# Altium schematic sheet 0061_DG2 DISPLAY - HDMI.SchDoc
size 848 x 558 mm
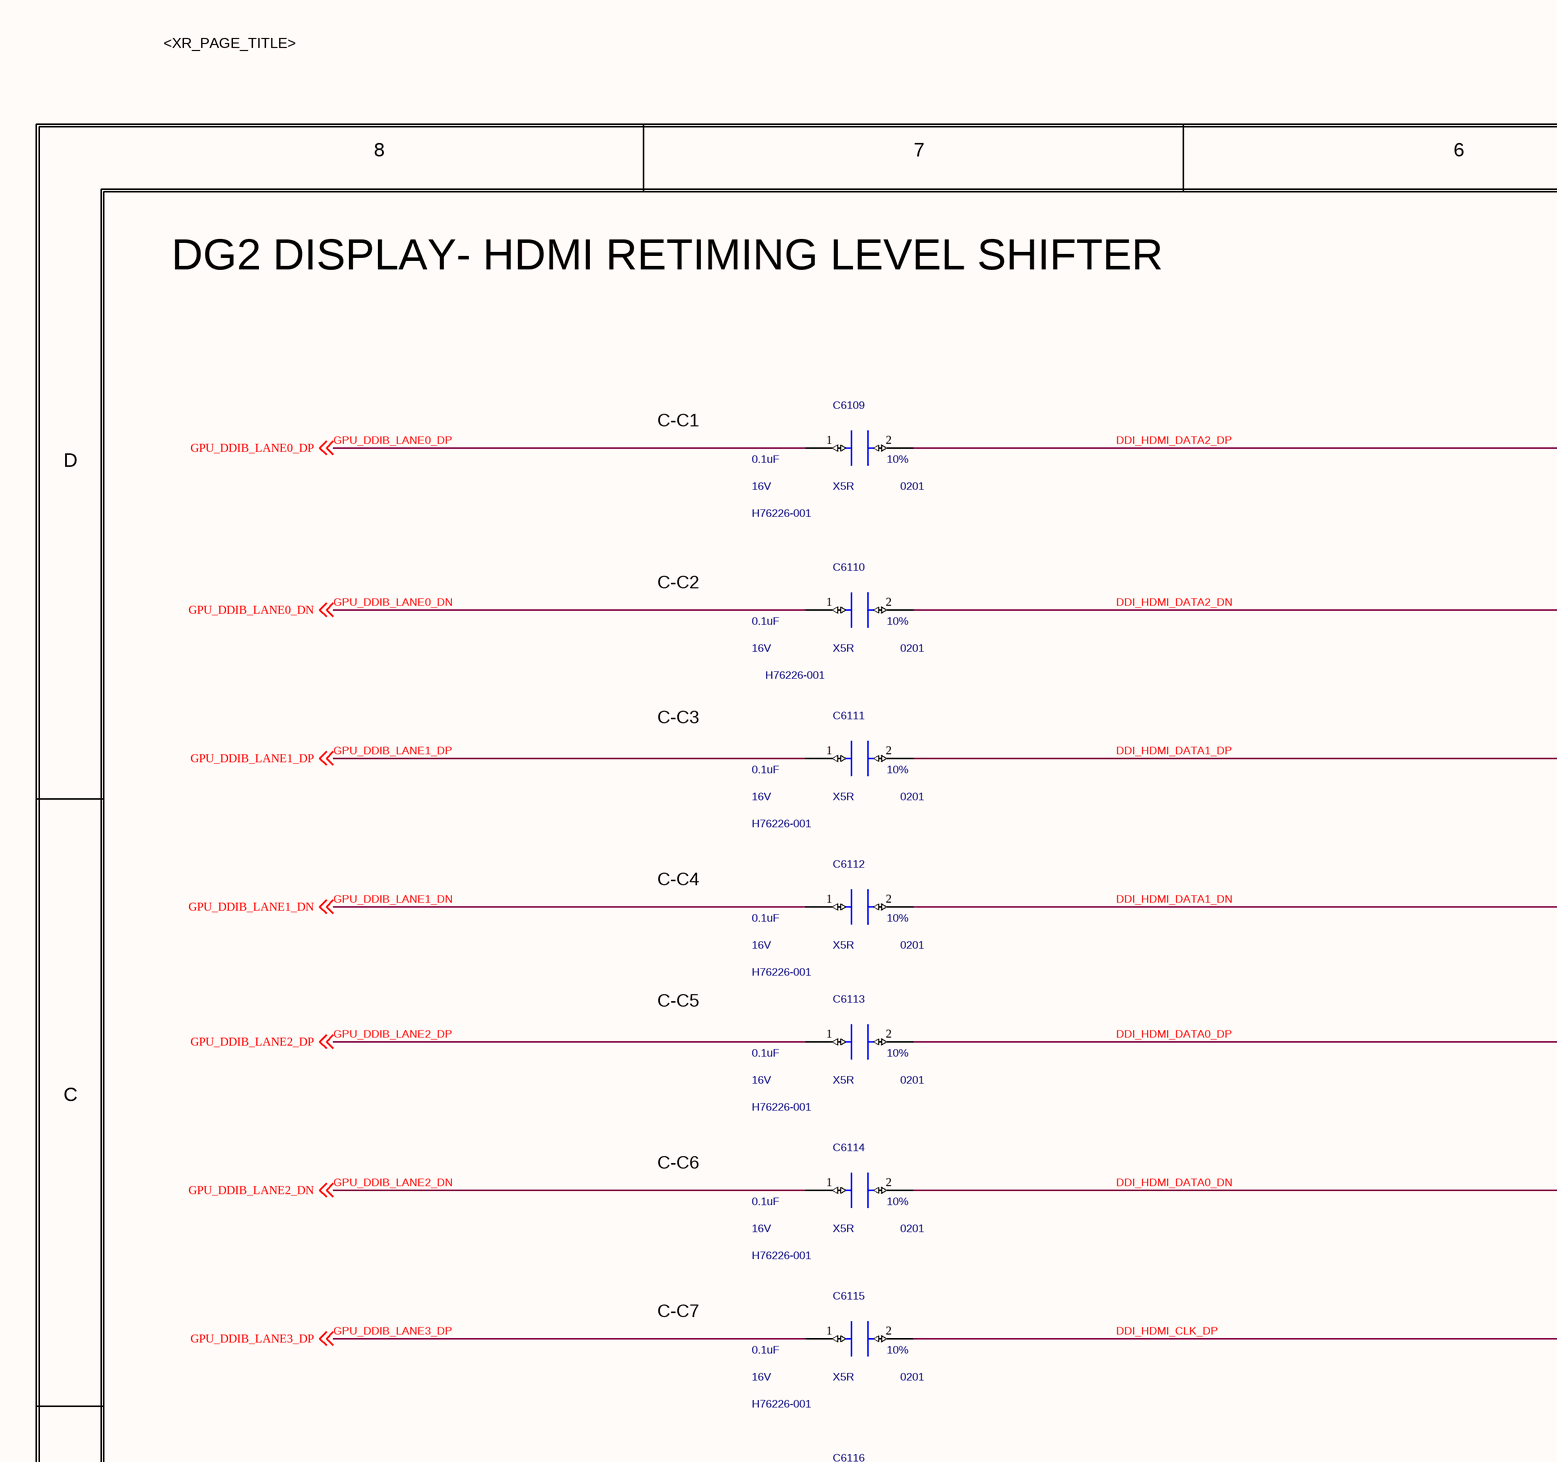
[diagram p0: 0061_DG2 DISPLAY - HDMI.SchDoc, top left]
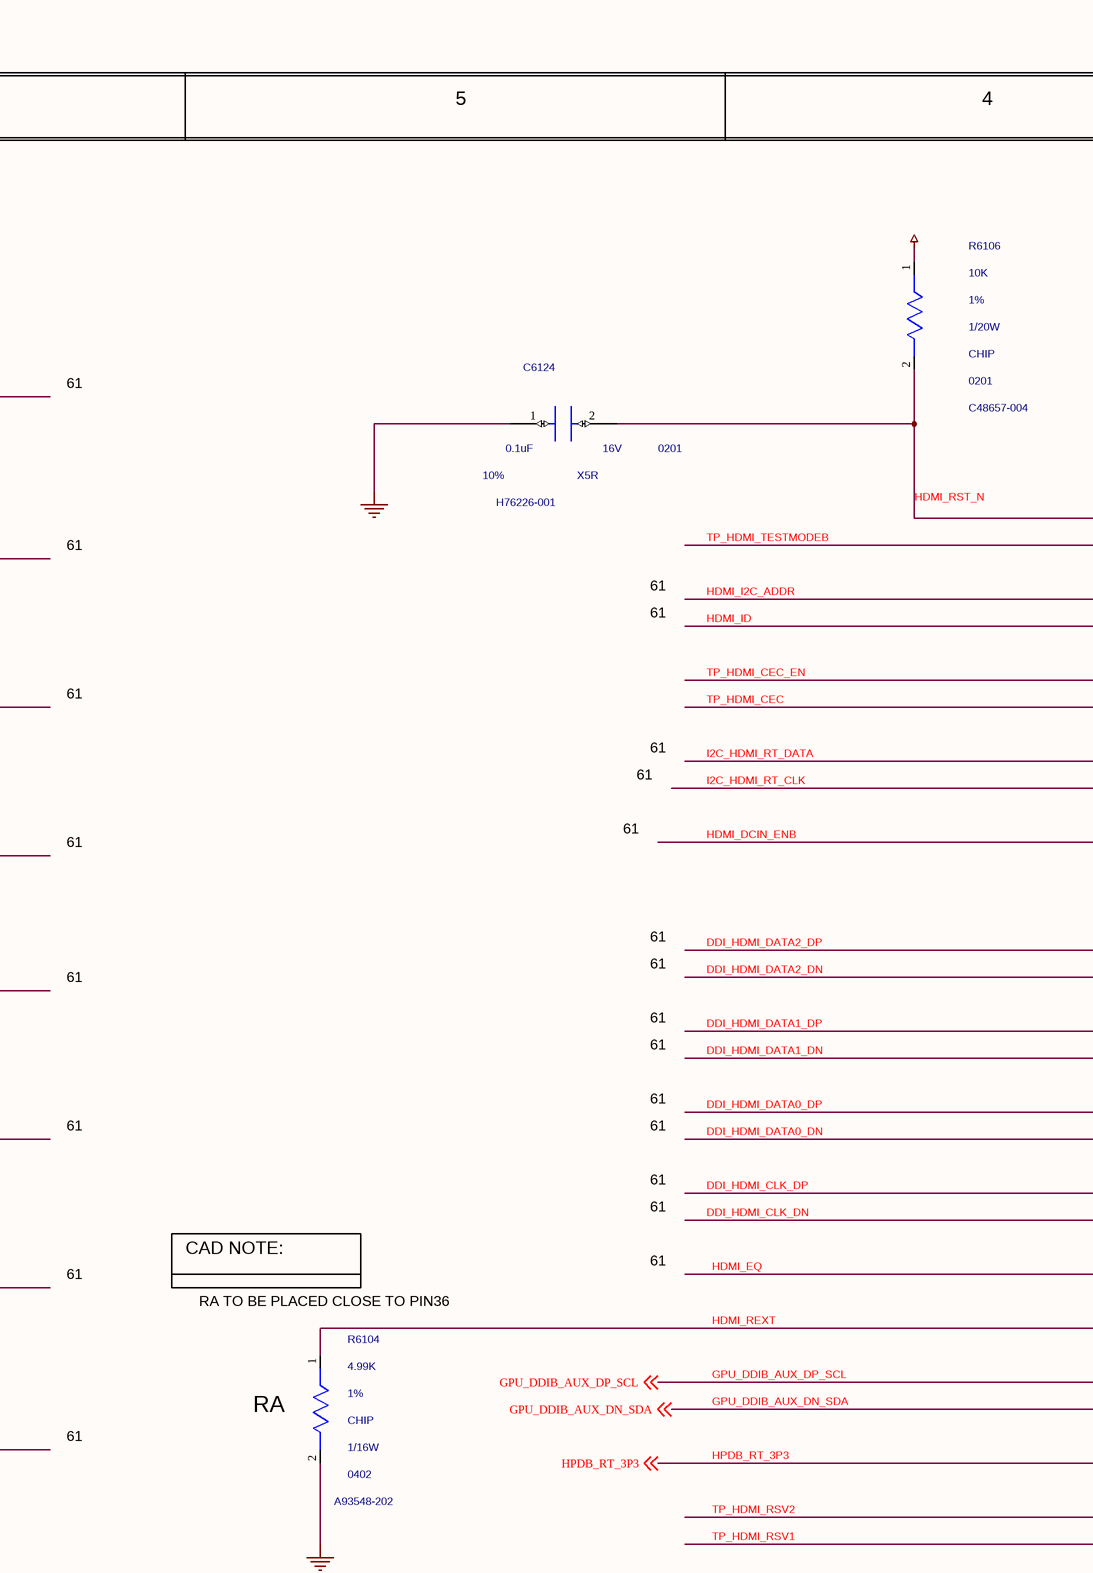
[diagram p1: 0061_DG2 DISPLAY - HDMI.SchDoc, top middle]
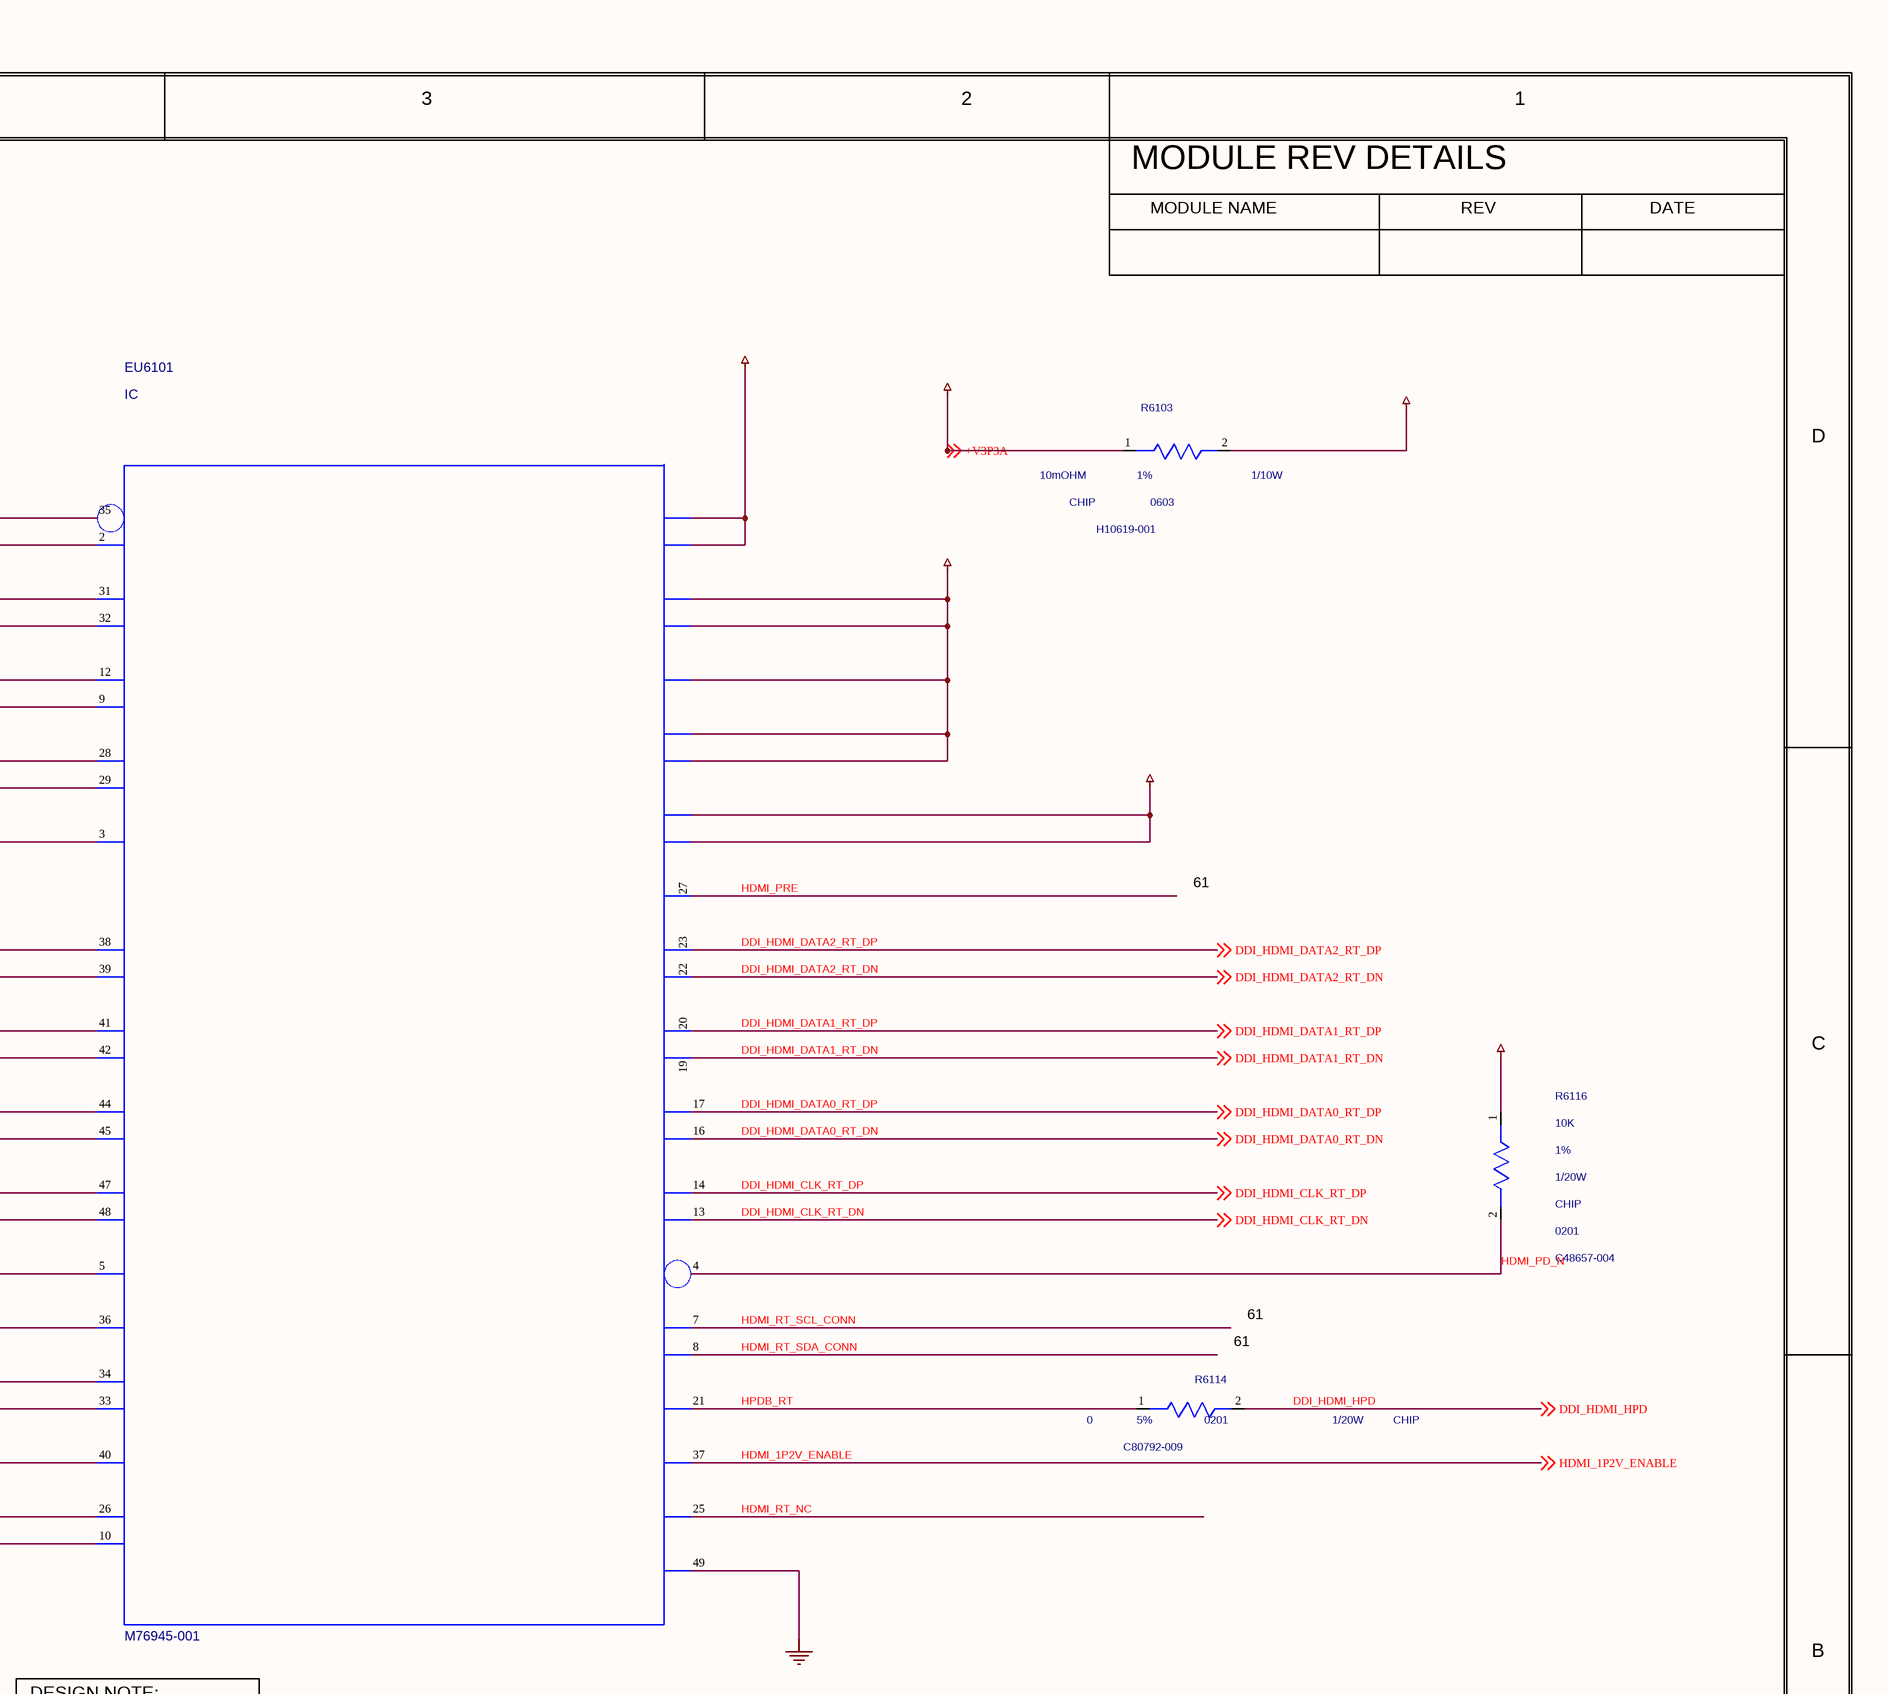
[diagram p2: 0061_DG2 DISPLAY - HDMI.SchDoc, top right]
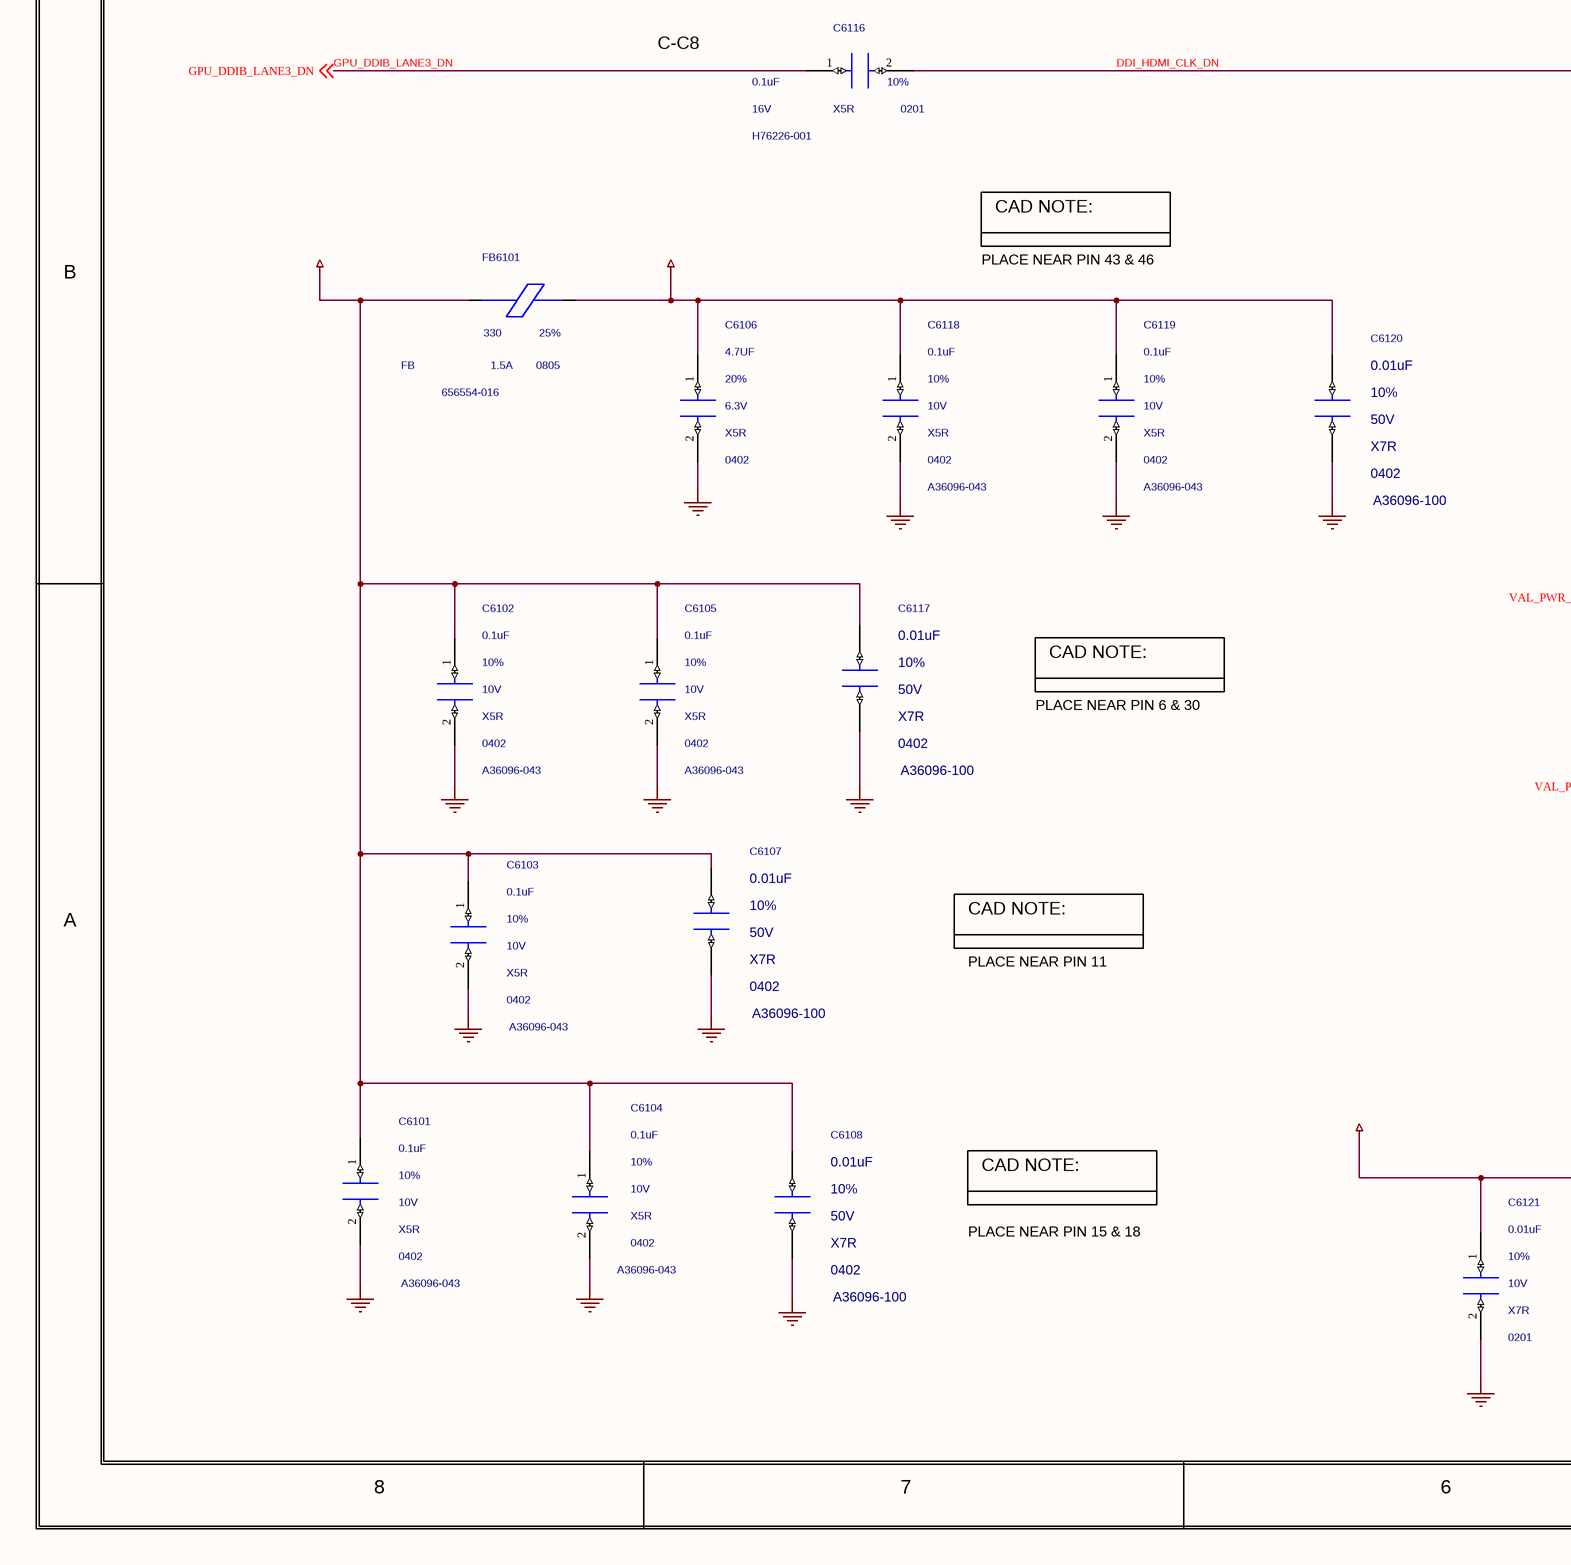
[diagram p3: 0061_DG2 DISPLAY - HDMI.SchDoc, bottom left]
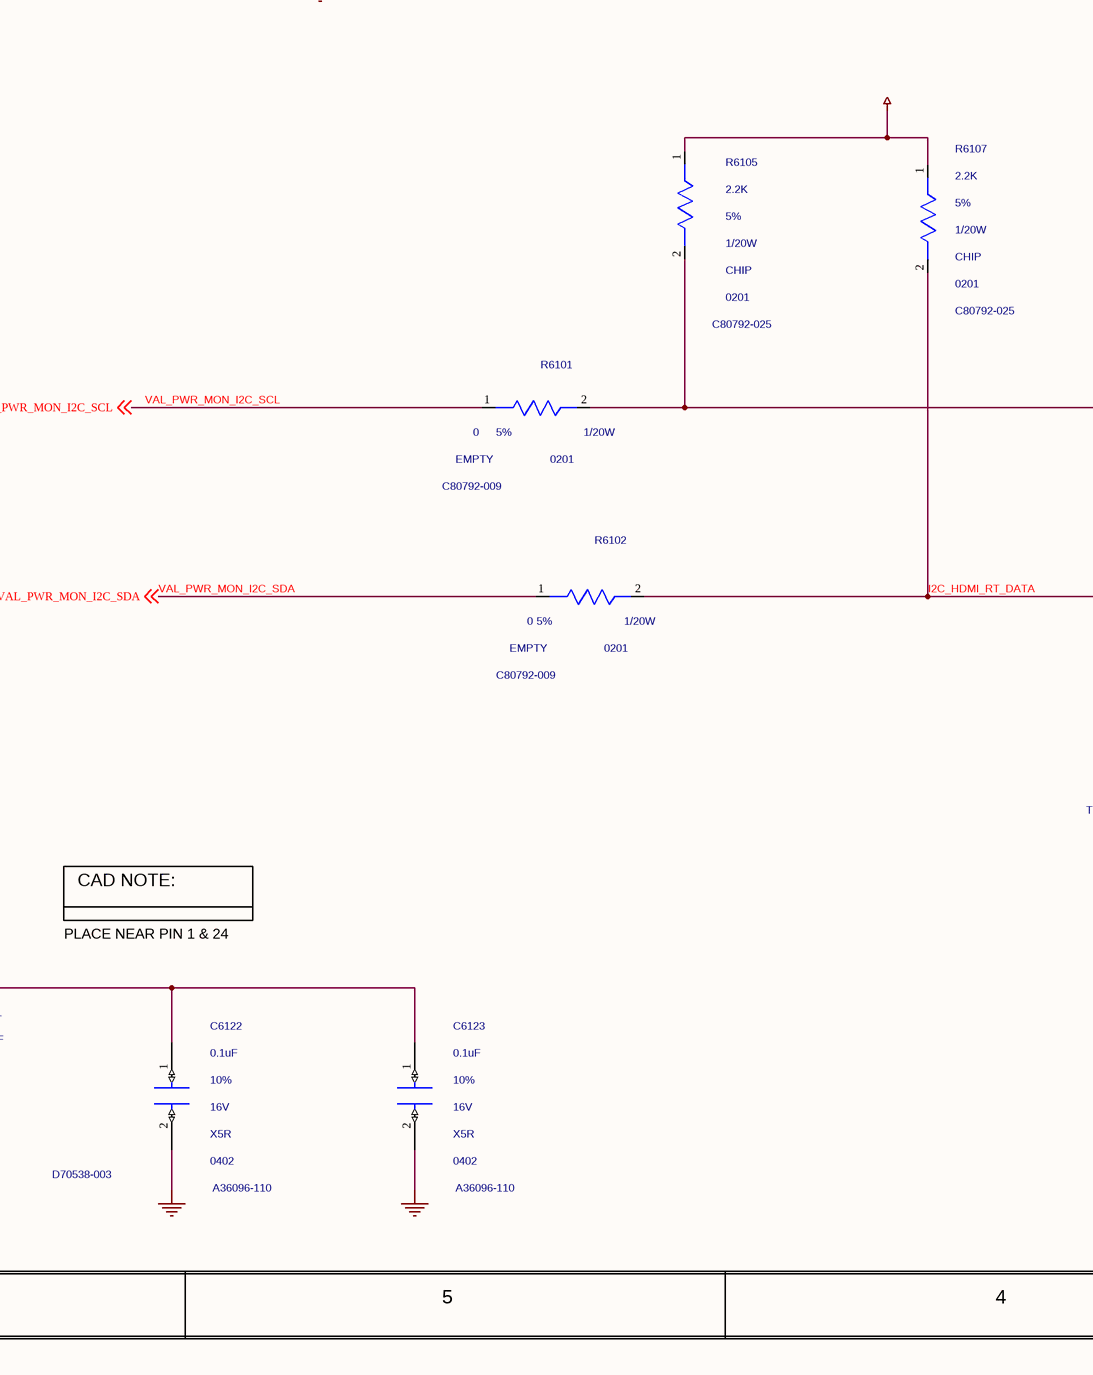
[diagram p4: 0061_DG2 DISPLAY - HDMI.SchDoc, bottom middle]
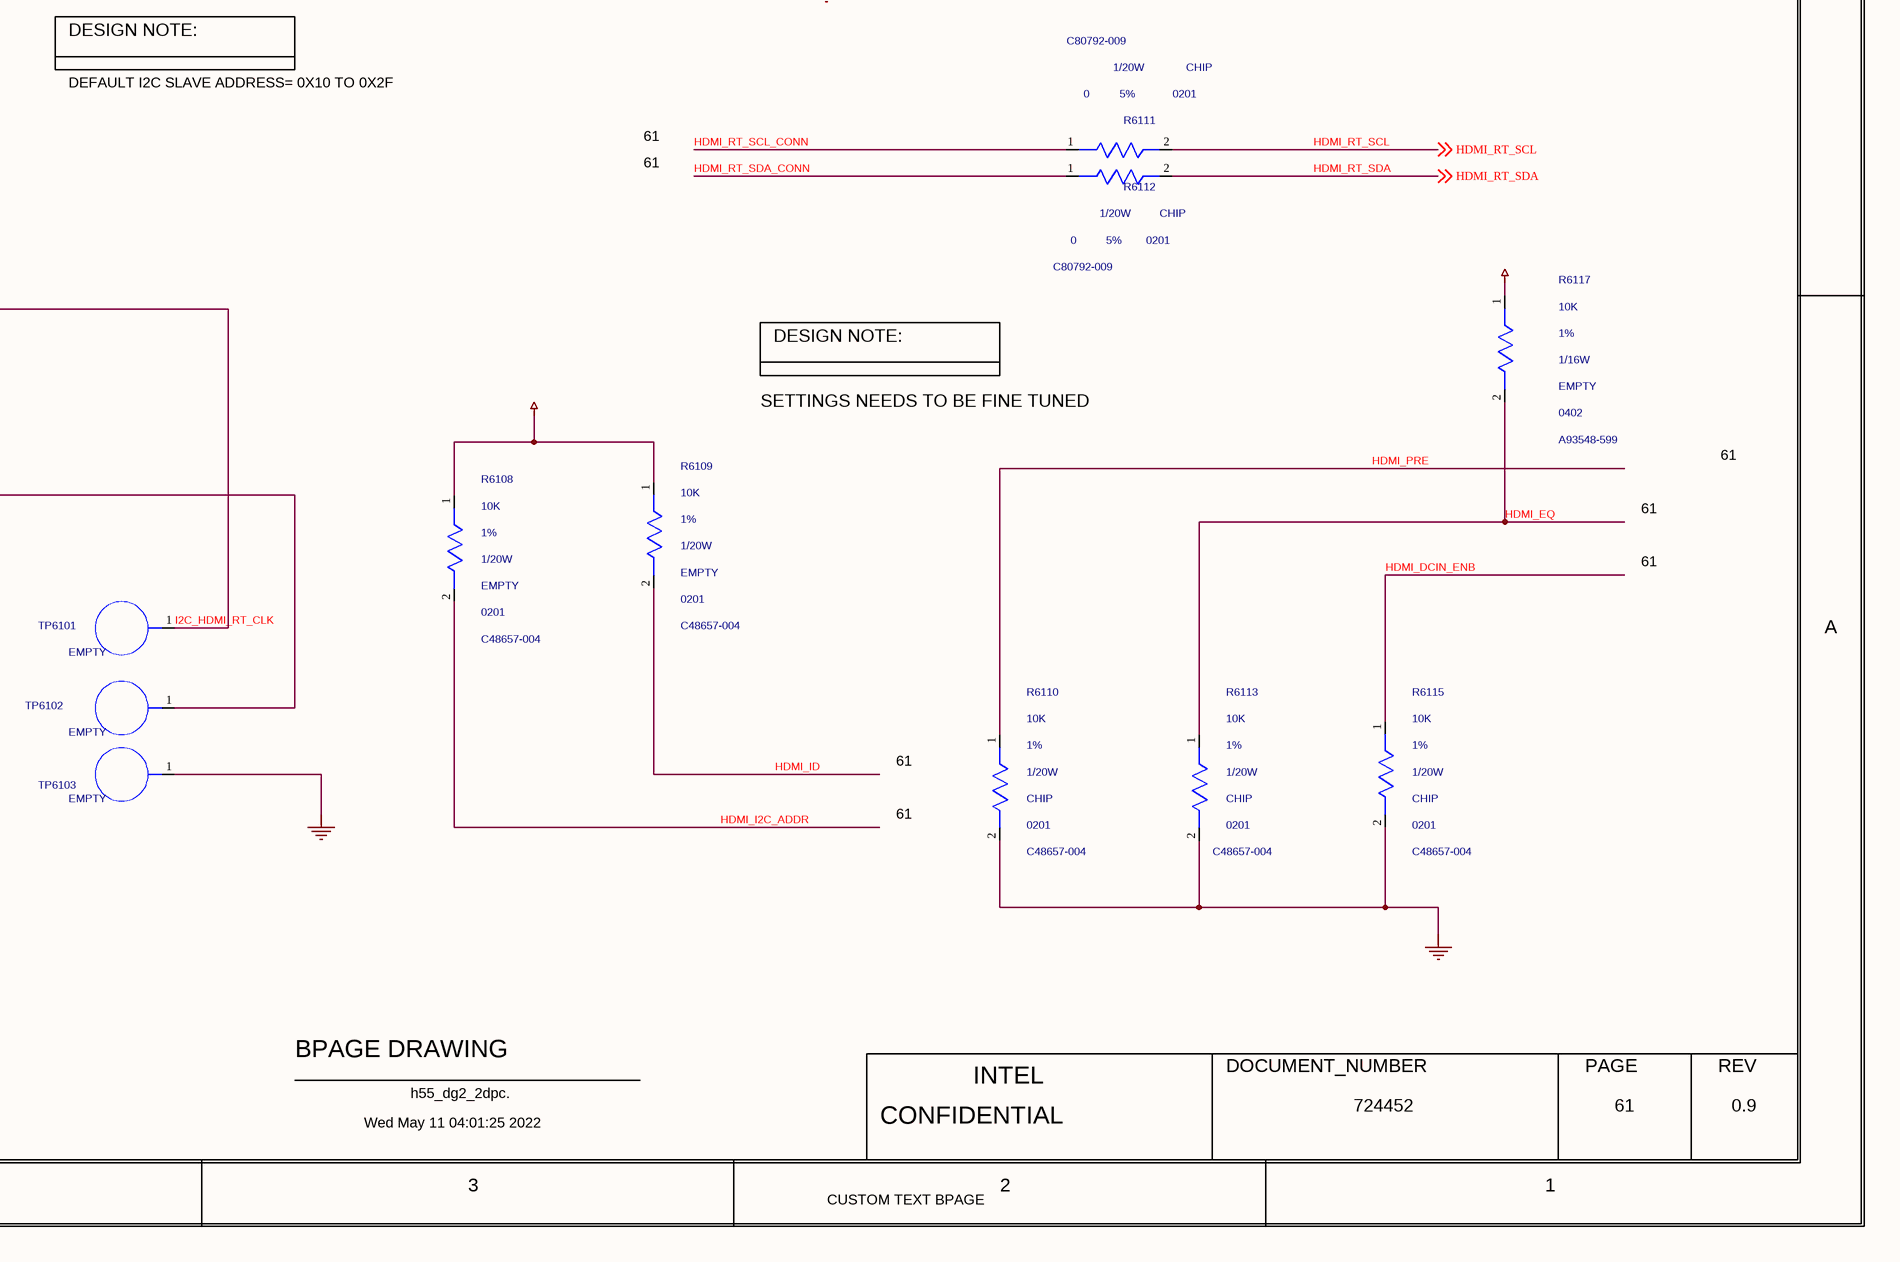
[diagram p5: 0061_DG2 DISPLAY - HDMI.SchDoc, bottom right]

## Parts
C6101  0.1uF  MATERIAL: X5R  PACK_TYPE: 0402  PART_NUMBER: A36096-043  TOLERANCE: 10%  VOLTAGE: 10V  [SMC0402IA]
C6102  0.1uF  MATERIAL: X5R  PACK_TYPE: 0402  PART_NUMBER: A36096-043  TOLERANCE: 10%  VOLTAGE: 10V  [SMC0402IA]
C6103  0.1uF  MATERIAL: X5R  PACK_TYPE: 0402  PART_NUMBER: A36096-043  TOLERANCE: 10%  VOLTAGE: 10V  [SMC0402IA]
C6104  0.1uF  MATERIAL: X5R  PACK_TYPE: 0402  PART_NUMBER: A36096-043  TOLERANCE: 10%  VOLTAGE: 10V  [SMC0402IA]
C6105  0.1uF  MATERIAL: X5R  PACK_TYPE: 0402  PART_NUMBER: A36096-043  TOLERANCE: 10%  VOLTAGE: 10V  [SMC0402IA]
C6106  4.7UF  MATERIAL: X5R  PACK_TYPE: 0402  TOLERANCE: 20%  VOLTAGE: 6.3V  [SMC0402IA]
C6107  0.01uF  MATERIAL: X7R  PACK_TYPE: 0402  PART_NUMBER: A36096-100  TOLERANCE: 10%  VOLTAGE: 50V  [CTK2_SM0402_1050X550_MA]
C6108  0.01uF  MATERIAL: X7R  PACK_TYPE: 0402  PART_NUMBER: A36096-100  TOLERANCE: 10%  VOLTAGE: 50V  [CTK2_SM0402_1050X550_MA]
C6109  0.1uF  MATERIAL: X5R  PACK_TYPE: 0201  PART_NUMBER: H76226-001  TOLERANCE: 10%  VOLTAGE: 16V  [SMC0201MB]
C6110  0.1uF  MATERIAL: X5R  PACK_TYPE: 0201  PART_NUMBER: H76226-001  TOLERANCE: 10%  VOLTAGE: 16V  [SMC0201MB]
C6111  0.1uF  MATERIAL: X5R  PACK_TYPE: 0201  PART_NUMBER: H76226-001  TOLERANCE: 10%  VOLTAGE: 16V  [SMC0201MB]
C6112  0.1uF  MATERIAL: X5R  PACK_TYPE: 0201  PART_NUMBER: H76226-001  TOLERANCE: 10%  VOLTAGE: 16V  [SMC0201MB]
C6113  0.1uF  MATERIAL: X5R  PACK_TYPE: 0201  PART_NUMBER: H76226-001  TOLERANCE: 10%  VOLTAGE: 16V  [SMC0201MB]
C6114  0.1uF  MATERIAL: X5R  PACK_TYPE: 0201  PART_NUMBER: H76226-001  TOLERANCE: 10%  VOLTAGE: 16V  [SMC0201MB]
C6115  0.1uF  MATERIAL: X5R  PACK_TYPE: 0201  PART_NUMBER: H76226-001  TOLERANCE: 10%  VOLTAGE: 16V  [SMC0201MB]
C6116  0.1uF  MATERIAL: X5R  PACK_TYPE: 0201  PART_NUMBER: H76226-001  TOLERANCE: 10%  VOLTAGE: 16V  [SMC0201MB]
C6117  0.01uF  MATERIAL: X7R  PACK_TYPE: 0402  PART_NUMBER: A36096-100  TOLERANCE: 10%  VOLTAGE: 50V  [CTK2_SM0402_1050X550_MA]
C6118  0.1uF  MATERIAL: X5R  PACK_TYPE: 0402  PART_NUMBER: A36096-043  TOLERANCE: 10%  VOLTAGE: 10V  [SMC0402IA]
C6119  0.1uF  MATERIAL: X5R  PACK_TYPE: 0402  PART_NUMBER: A36096-043  TOLERANCE: 10%  VOLTAGE: 10V  [SMC0402IA]
C6120  0.01uF  MATERIAL: X7R  PACK_TYPE: 0402  PART_NUMBER: A36096-100  TOLERANCE: 10%  VOLTAGE: 50V  [CTK2_SM0402_1050X550_MA]
C6121  0.01uF  MATERIAL: X7R  PACK_TYPE: 0201  PART_NUMBER: D70538-003  TOLERANCE: 10%  VOLTAGE: 10V  [SMC0201IA]
C6122  0.1uF  MATERIAL: X5R  PACK_TYPE: 0402  PART_NUMBER: A36096-110  TOLERANCE: 10%  VOLTAGE: 16V  [SMC0402IA]
C6123  0.1uF  MATERIAL: X5R  PACK_TYPE: 0402  PART_NUMBER: A36096-110  TOLERANCE: 10%  VOLTAGE: 16V  [SMC0402IA]
C6124  0.1uF  MATERIAL: X5R  PACK_TYPE: 0201  PART_NUMBER: H76226-001  TOLERANCE: 10%  VOLTAGE: 16V  [SMC0201MB]
EU6101  MATERIAL: IC  PART_NUMBER: M76945-001  [CTK2_LCC48_S6100_400_DFS4500_MA]  (hidden comment: C_PS8409A)
FB6101  330  CURRENT: 1.5A  MATERIAL: FB  PACK_TYPE: 0805  PART_NUMBER: 656554-016  TOLERANCE: 25%  [CTK0_SM0805_2200X1450_MA]
R6101  0  MATERIAL: EMPTY  PACK_TYPE: 0201  PART_NUMBER: C80792-009  TOLERANCE: 5%  WATTAGE: 1/20W  [SMR0201IA]
R6102  0  MATERIAL: EMPTY  PACK_TYPE: 0201  PART_NUMBER: C80792-009  TOLERANCE: 5%  WATTAGE: 1/20W  [SMR0201IA]
R6103  10mOHM  MATERIAL: CHIP  PACK_TYPE: 0603  PART_NUMBER: H10619-001  TOLERANCE: 1%  WATTAGE: 1/10W  [SMR0603IC]
R6104  4.99K  MATERIAL: CHIP  PACK_TYPE: 0402  PART_NUMBER: A93548-202  TOLERANCE: 1%  WATTAGE: 1/16W  [SMR0402IA]
R6105  2.2K  MATERIAL: CHIP  PACK_TYPE: 0201  PART_NUMBER: C80792-025  TOLERANCE: 5%  WATTAGE: 1/20W  [SMR0201IA]
R6106  10K  MATERIAL: CHIP  PACK_TYPE: 0201  PART_NUMBER: C48657-004  TOLERANCE: 1%  WATTAGE: 1/20W  [SMR0201IA]
R6107  2.2K  MATERIAL: CHIP  PACK_TYPE: 0201  PART_NUMBER: C80792-025  TOLERANCE: 5%  WATTAGE: 1/20W  [SMR0201IA]
R6108  10K  MATERIAL: EMPTY  PACK_TYPE: 0201  PART_NUMBER: C48657-004  TOLERANCE: 1%  WATTAGE: 1/20W  [SMR0201IA]
R6109  10K  MATERIAL: EMPTY  PACK_TYPE: 0201  PART_NUMBER: C48657-004  TOLERANCE: 1%  WATTAGE: 1/20W  [SMR0201IA]
R6110  10K  MATERIAL: CHIP  PACK_TYPE: 0201  PART_NUMBER: C48657-004  TOLERANCE: 1%  WATTAGE: 1/20W  [SMR0201IA]
R6111  0  MATERIAL: CHIP  PACK_TYPE: 0201  PART_NUMBER: C80792-009  TOLERANCE: 5%  WATTAGE: 1/20W  [SMR0201IA]
R6112  0  MATERIAL: CHIP  PACK_TYPE: 0201  PART_NUMBER: C80792-009  TOLERANCE: 5%  WATTAGE: 1/20W  [SMR0201IA]
R6113  10K  MATERIAL: CHIP  PACK_TYPE: 0201  PART_NUMBER: C48657-004  TOLERANCE: 1%  WATTAGE: 1/20W  [SMR0201IA]
R6114  0  MATERIAL: CHIP  PACK_TYPE: 0201  PART_NUMBER: C80792-009  TOLERANCE: 5%  WATTAGE: 1/20W  [SMR0201IA]
R6115  10K  MATERIAL: CHIP  PACK_TYPE: 0201  PART_NUMBER: C48657-004  TOLERANCE: 1%  WATTAGE: 1/20W  [SMR0201IA]
R6116  10K  MATERIAL: CHIP  PACK_TYPE: 0201  PART_NUMBER: C48657-004  TOLERANCE: 1%  WATTAGE: 1/20W  [SMR0201IA]
R6117  10K  MATERIAL: EMPTY  PACK_TYPE: 0402  PART_NUMBER: A93548-599  TOLERANCE: 1%  WATTAGE: 1/16W  [SMR0402IA]
TP6101  MATERIAL: EMPTY  [TPS16]  (hidden comment: TP)
TP6102  MATERIAL: EMPTY  [TPS16]  (hidden comment: TP)
TP6103  MATERIAL: EMPTY  [TPS16]  (hidden comment: TP)

## Nets
+V1P2S_HDMI_R_RTR: C6106.1(A) C6118.1(A) C6119.1(A) C6120.1(A) FB6101.2(B)
+V1P2S_HDMI_RTR: C6101.1(A) C6102.1(A) C6103.1(A) C6104.1(A) C6105.1(A) C6107.1(A) C6108.1(A) C6117.1(A) FB6101.1(A)
+V3P3A: R6103.1(A) ; off-sheet +V3P3A
+V3P3A_HDMI_RTR: C6121.1(A) C6122.1(A) C6123.1(A) R6103.2(B) R6105.1(A) R6106.1(A) R6107.1(A) R6108.1(A) R6109.1(A) R6116.1(A) R6117.1(A)
GND: C6101.2(B) C6102.2(B) C6103.2(B) C6104.2(B) C6105.2(B) C6106.2(B) C6107.2(B) C6108.2(B) C6117.2(B) C6118.2(B) C6119.2(B) C6120.2(B) C6121.2(B) C6122.2(B) C6123.2(B) C6124.1(A) EU6101.49(THPAD) R6104.2(B) R6110.2(B) R6113.2(B) R6115.2(B) TP6103.1(TP)
VDD12_1: EU6101.6(VDD12_1)
VDD12_2: EU6101.30(VDD12_2)
VDD33_1: EU6101.1(VDD33_1)
VDD33_2: EU6101.24(VDD33_2)
VDDA12: EU6101.11(VDDA12)
VDDRX12_1: EU6101.43(VDDRX12_1)
VDDRX12_2: EU6101.46(VDDRX12_2)
VDDTX12_1: EU6101.15(VDDTX12_1)
VDDTX12_2: EU6101.18(VDDTX12_2)
DDI_HDMI_CLK_DN: C6116.2(B) EU6101.48(IN_CLKN)
DDI_HDMI_CLK_DP: C6115.2(B) EU6101.47(IN_CLKP)
DDI_HDMI_CLK_RT_DN: EU6101.13(OUT_CLKN) ; off-sheet DDI_HDMI_CLK_RT_DN
DDI_HDMI_CLK_RT_DP: EU6101.14(OUT_CLKP) ; off-sheet DDI_HDMI_CLK_RT_DP
DDI_HDMI_DATA0_DN: C6114.2(B) EU6101.45(IN_D0N)
DDI_HDMI_DATA0_DP: C6113.2(B) EU6101.44(IN_D0P)
DDI_HDMI_DATA0_RT_DN: EU6101.16(OUT_D0N) ; off-sheet DDI_HDMI_DATA0_RT_DN
DDI_HDMI_DATA0_RT_DP: EU6101.17(OUT_D0P) ; off-sheet DDI_HDMI_DATA0_RT_DP
DDI_HDMI_DATA1_DN: C6112.2(B) EU6101.42(IN_D1N)
DDI_HDMI_DATA1_DP: C6111.2(B) EU6101.41(IN_D1P)
DDI_HDMI_DATA1_RT_DN: EU6101.19(OUT_D1N) ; off-sheet DDI_HDMI_DATA1_RT_DN
DDI_HDMI_DATA1_RT_DP: EU6101.20(OUT_D1P) ; off-sheet DDI_HDMI_DATA1_RT_DP
DDI_HDMI_DATA2_DN: C6110.2(B) EU6101.39(IN_D2N)
DDI_HDMI_DATA2_DP: C6109.2(B) EU6101.38(IN_D2P)
DDI_HDMI_DATA2_RT_DN: EU6101.22(OUT_D2N) ; off-sheet DDI_HDMI_DATA2_RT_DN
DDI_HDMI_DATA2_RT_DP: EU6101.23(OUT_D2P) ; off-sheet DDI_HDMI_DATA2_RT_DP
DDI_HDMI_HPD: R6114.2(B) ; off-sheet DDI_HDMI_HPD
GPU_DDIB_AUX_DN_SDA: EU6101.33(SDA_SRC_AUXN) ; off-sheet GPU_DDIB_AUX_DN_SDA
GPU_DDIB_AUX_DP_SCL: EU6101.34(SCL_SRC_AUXP) ; off-sheet GPU_DDIB_AUX_DP_SCL
GPU_DDIB_LANE0_DN: C6110.1(A) ; off-sheet GPU_DDIB_LANE0_DN
GPU_DDIB_LANE0_DP: C6109.1(A) ; off-sheet GPU_DDIB_LANE0_DP
GPU_DDIB_LANE1_DN: C6112.1(A) ; off-sheet GPU_DDIB_LANE1_DN
GPU_DDIB_LANE1_DP: C6111.1(A) ; off-sheet GPU_DDIB_LANE1_DP
GPU_DDIB_LANE2_DN: C6114.1(A) ; off-sheet GPU_DDIB_LANE2_DN
GPU_DDIB_LANE2_DP: C6113.1(A) ; off-sheet GPU_DDIB_LANE2_DP
GPU_DDIB_LANE3_DN: C6116.1(A) ; off-sheet GPU_DDIB_LANE3_DN
GPU_DDIB_LANE3_DP: C6115.1(A) ; off-sheet GPU_DDIB_LANE3_DP
HDMI_1P2V_ENABLE: EU6101.37(POWERSWITCH) ; off-sheet HDMI_1P2V_ENABLE
HDMI_DCIN_ENB: EU6101.3(DCIN_ENB) R6115.1(A)
HDMI_EQ: EU6101.5(EQ) R6113.1(A) R6117.2(B)
HDMI_I2C_ADDR: EU6101.31(I2C_ADDR) R6108.2(B)
HDMI_ID: EU6101.32(HDMI_ID) R6109.2(B)
HDMI_PD_N: EU6101.4(PDB) R6116.2(B)
HDMI_PRE: EU6101.27(PRE) R6110.1(A)
HDMI_REXT: EU6101.36(REXT) R6104.1(A)
HDMI_RST_N: C6124.2(B) EU6101.35(RESETB) R6106.2(B)
HDMI_RT_NC: EU6101.25(NC)
HDMI_RT_SCL: R6111.2(B) ; off-sheet HDMI_RT_SCL
HDMI_RT_SCL_CONN: EU6101.7(SCL_SNK) R6111.1(A)
HDMI_RT_SDA: R6112.2(B) ; off-sheet HDMI_RT_SDA
HDMI_RT_SDA_CONN: EU6101.8(SDA_SNK) R6112.1(A)
HPDB_RT: EU6101.21(HPD_SNK) R6114.1(A)
HPDB_RT_3P3: EU6101.40(HPD_SRC) ; off-sheet HPDB_RT_3P3
I2C_HDMI_RT_CLK: EU6101.29(CSCL) R6101.2(B) R6105.2(B) TP6101.1(TP)
I2C_HDMI_RT_DATA: EU6101.28(CSDA) R6102.2(B) R6107.2(B) TP6102.1(TP)
TP_HDMI_CEC: EU6101.9(HDMI_CEC)
TP_HDMI_CEC_EN: EU6101.12(CEC_EN)
TP_HDMI_RSV1: EU6101.10(RSV1)
TP_HDMI_RSV2: EU6101.26(RSV2)
TP_HDMI_TESTMODEB: EU6101.2(TESTMODEB)
VAL_PWR_MON_I2C_SCL: R6101.1(A) ; off-sheet VAL_PWR_MON_I2C_SCL
VAL_PWR_MON_I2C_SDA: R6102.1(A) ; off-sheet VAL_PWR_MON_I2C_SDA

## Notes on the sheet
- <XR_PAGE_TITLE>
- 8
- 7
- 6
- 5
- 4
- 3
- 2
- 1
- MODULE REV DETAILS
- DG2 DISPLAY- HDMI RETIMING LEVEL SHIFTER
- MODULE NAME
- REV
- DATE
- C-C1
- 61
- D
- C-C2
- C-C3
- C-C4
- C-C5
- C
- C-C6
- C-C7
- CAD NOTE:
- RA TO BE PLACED CLOSE TO PIN36
- (near R6104) RA
- C-C8
- B
- PLACE NEAR PIN 43 & 46
- DESIGN NOTE:
- DEFAULT I2C SLAVE ADDRESS= 0X10 TO 0X2F
- PLACE NEAR PIN 6 & 30
- SETTINGS NEEDS TO BE FINE TUNED
- A
- PLACE NEAR PIN 11
- PLACE NEAR PIN 1 & 24
- PLACE NEAR PIN 15 & 18
- BPAGE DRAWING
- INTEL
- DOCUMENT_NUMBER
- PAGE
- Wed May 11 04:01:25 2022
- h55_dg2_2dpc.
- CONFIDENTIAL
- 724452
- 0.9
- CUSTOM TEXT BPAGE

## Library data of the parts
C6101 = CAP: CDS_PHYS_PART_NAME: CAP_0402-A36096-043,X5R,0.1UF,10V,10%,LPDB,GENERIC; OriginalSymbolOrigin: (-50,25); XY: (-4650,475); VER: 1; ROT: 0; PHYS_PAGE: 61; LOCATION: C6101; IP: GENERIC; FP_TECH: LPDB; DRAWING: @RVP1_ADL_SB_ADP_S_DDR5_SODIMM_2DPC_LIB.H55_DG2_2DPC(SCH_1):PAGE61; CDS_LIB: discrete; PCB Footprint: SMC0402IA; CHIPS_PART_NAME: CAP; CDS_PART_NAME: CAP_0402-A36096-043,X5R,0.1UF,10V,10%,LPDB,GENERIC; CDS_LOCATION: C6101
C6102 = CAP: CDS_PHYS_PART_NAME: CAP_0402-A36096-043,X5R,0.1UF,10V,10%,LPDB,GENERIC; OriginalSymbolOrigin: (-50,25); XY: (-4475,1400); VER: 1; ROT: 0; PHYS_PAGE: 61; LOCATION: C6102; IP: GENERIC; FP_TECH: LPDB; DRAWING: @RVP1_ADL_SB_ADP_S_DDR5_SODIMM_2DPC_LIB.H55_DG2_2DPC(SCH_1):PAGE61; CDS_LIB: discrete; PCB Footprint: SMC0402IA; CHIPS_PART_NAME: CAP; CDS_PART_NAME: CAP_0402-A36096-043,X5R,0.1UF,10V,10%,LPDB,GENERIC; CDS_LOCATION: C6102
C6103 = CAP: CDS_PHYS_PART_NAME: CAP_0402-A36096-043,X5R,0.1UF,10V,10%,LPDB,GENERIC; OriginalSymbolOrigin: (-50,25); XY: (-4450,950); VER: 1; ROT: 0; PHYS_PAGE: 61; LOCATION: C6103; IP: GENERIC; FP_TECH: LPDB; DRAWING: @RVP1_ADL_SB_ADP_S_DDR5_SODIMM_2DPC_LIB.H55_DG2_2DPC(SCH_1):PAGE61; CDS_LIB: discrete; PCB Footprint: SMC0402IA; CHIPS_PART_NAME: CAP; CDS_PART_NAME: CAP_0402-A36096-043,X5R,0.1UF,10V,10%,LPDB,GENERIC; CDS_LOCATION: C6103
C6104 = CAP: CDS_PHYS_PART_NAME: CAP_0402-A36096-043,X5R,0.1UF,10V,10%,LPDB,GENERIC; OriginalSymbolOrigin: (-50,25); XY: (-4225,450); VER: 1; ROT: 0; PHYS_PAGE: 61; LOCATION: C6104; IP: GENERIC; FP_TECH: LPDB; DRAWING: @RVP1_ADL_SB_ADP_S_DDR5_SODIMM_2DPC_LIB.H55_DG2_2DPC(SCH_1):PAGE61; CDS_LIB: discrete; PCB Footprint: SMC0402IA; CHIPS_PART_NAME: CAP; CDS_PART_NAME: CAP_0402-A36096-043,X5R,0.1UF,10V,10%,LPDB,GENERIC; CDS_LOCATION: C6104
C6105 = CAP: CDS_PHYS_PART_NAME: CAP_0402-A36096-043,X5R,0.1UF,10V,10%,LPDB,GENERIC; OriginalSymbolOrigin: (-50,25); XY: (-4100,1400); VER: 1; ROT: 0; PHYS_PAGE: 61; LOCATION: C6105; IP: GENERIC; FP_TECH: LPDB; DRAWING: @RVP1_ADL_SB_ADP_S_DDR5_SODIMM_2DPC_LIB.H55_DG2_2DPC(SCH_1):PAGE61; CDS_LIB: discrete; PCB Footprint: SMC0402IA; CHIPS_PART_NAME: CAP; CDS_PART_NAME: CAP_0402-A36096-043,X5R,0.1UF,10V,10%,LPDB,GENERIC; CDS_LOCATION: C6105
C6106 = CAP: PART_NUMBER: A36096-107; CDS_PHYS_PART_NAME: CAP_0402-A36096-107,X5R,4.7UF,6.3V,20%,LPDB,GENERIC; OriginalSymbolOrigin: (-50,25); XY: (-4025,1925); VER: 1; SUITE: ADL; SUB_ROOM: HDMI_RETIMER; ROT: 0; ROOM1: HDMI; PHYS_PAGE: 61; LOCATION: C6106; DRAWING: @RVP1_ADL_SB_ADP_S_DDR5_SODIMM_2DPC_LIB.H55_DG2_2DPC(SCH_1):PAGE61; CONFIG: GENERAL; CDS_LIB: discrete; PCB Footprint: SMC0402IA; CHIPS_PART_NAME: CAP; CDS_PART_NAME: CAP_0402-A36096-107,X5R,4.7UF,6.3V,20%,LPDB,GENERIC; CDS_LOCATION: C6106
C6107 = C_CAP: CDS_PHYS_PART_NAME: C_CAP_0402-A36096-100,X7R,0.01UF,50V,10%,TK2,GENERIC; CDS_LMAN_SYM_OUTLINE: -50,50,50,-50; FP_TECH: TK2; IP: GENERIC; ROOM: NONE; OriginalSymbolOrigin: (-50,25); XY: (-4000,975); VER: 1; ROT: 0; PHYS_PAGE: 61; LOCATION: C6107; DRAWING: @RVP1_ADL_SB_ADP_S_DDR5_SODIMM_2DPC_LIB.H55_DG2_2DPC(SCH_1):PAGE61; CDS_LIB: c_discrete; VARIANT: ?; PCB Footprint: CTK2_SM0402_1050X550_MA; CHIPS_PART_NAME: C_CAP; CDS_PART_NAME: C_CAP_0402-A36096-100,X7R,0.01UF,50V,10%,TK2,GENERIC; CDS_LOCATION: C6107
C6108 = C_CAP: CDS_PHYS_PART_NAME: C_CAP_0402-A36096-100,X7R,0.01UF,50V,10%,TK2,GENERIC; CDS_LMAN_SYM_OUTLINE: -50,50,50,-50; FP_TECH: TK2; IP: GENERIC; ROOM: NONE; OriginalSymbolOrigin: (-50,25); XY: (-3850,450); VER: 1; ROT: 0; PHYS_PAGE: 61; LOCATION: C6108; DRAWING: @RVP1_ADL_SB_ADP_S_DDR5_SODIMM_2DPC_LIB.H55_DG2_2DPC(SCH_1):PAGE61; CDS_LIB: c_discrete; VARIANT: ?; PCB Footprint: CTK2_SM0402_1050X550_MA; CHIPS_PART_NAME: C_CAP; CDS_PART_NAME: C_CAP_0402-A36096-100,X7R,0.01UF,50V,10%,TK2,GENERIC; CDS_LOCATION: C6108
C6109 = CAP#1: CHIPS_PART_NAME: CAP; CDS_PHYS_PART_NAME: CAP_0201-H76226-001,X5R,0.1UF,16V,10%,LPDB,GENERIC; OriginalSymbolOrigin: (-25,50); XY: (-3725,4500); VER: 2; SUITE: ADL; SUB_ROOM: HDMI_RETIMER; ROT: 0; ROOM1: HDMI; PHYS_PAGE: 61; LOCATION: C6109; DRAWING: @RVP1_ADL_SB_ADP_S_DDR5_SODIMM_2DPC_LIB.H55_DG2_2DPC(SCH_1):PAGE61; CONFIG: GENERAL; CDS_LIB: discrete; PCB Footprint: SMC0201MB; CDS_PART_NAME: CAP_0201-H76226-001,X5R,0.1UF,16V,10%,LPDB,GENERIC; CDS_LOCATION: C6109
C6110 = CAP#1: CHIPS_PART_NAME: CAP; CDS_PHYS_PART_NAME: CAP_0201-H76226-001,X5R,0.1UF,16V,10%,LPDB,GENERIC; OriginalSymbolOrigin: (-25,50); XY: (-3725,4200); VER: 2; SUITE: ADL; SUB_ROOM: HDMI_RETIMER; ROT: 0; ROOM1: HDMI; PHYS_PAGE: 61; LOCATION: C6110; DRAWING: @RVP1_ADL_SB_ADP_S_DDR5_SODIMM_2DPC_LIB.H55_DG2_2DPC(SCH_1):PAGE61; CONFIG: GENERAL; CDS_LIB: discrete; PCB Footprint: SMC0201MB; CDS_PART_NAME: CAP_0201-H76226-001,X5R,0.1UF,16V,10%,LPDB,GENERIC; CDS_LOCATION: C6110
C6111 = CAP#1: CHIPS_PART_NAME: CAP; CDS_PHYS_PART_NAME: CAP_0201-H76226-001,X5R,0.1UF,16V,10%,LPDB,GENERIC; OriginalSymbolOrigin: (-25,50); XY: (-3725,3925); VER: 2; SUITE: ADL; SUB_ROOM: HDMI_RETIMER; ROT: 0; ROOM1: HDMI; PHYS_PAGE: 61; LOCATION: C6111; DRAWING: @RVP1_ADL_SB_ADP_S_DDR5_SODIMM_2DPC_LIB.H55_DG2_2DPC(SCH_1):PAGE61; CONFIG: GENERAL; CDS_LIB: discrete; PCB Footprint: SMC0201MB; CDS_PART_NAME: CAP_0201-H76226-001,X5R,0.1UF,16V,10%,LPDB,GENERIC; CDS_LOCATION: C6111
C6112 = CAP#1: CHIPS_PART_NAME: CAP; CDS_PHYS_PART_NAME: CAP_0201-H76226-001,X5R,0.1UF,16V,10%,LPDB,GENERIC; OriginalSymbolOrigin: (-25,50); XY: (-3725,3650); VER: 2; SUITE: ADL; SUB_ROOM: HDMI_RETIMER; ROT: 0; ROOM1: HDMI; PHYS_PAGE: 61; LOCATION: C6112; DRAWING: @RVP1_ADL_SB_ADP_S_DDR5_SODIMM_2DPC_LIB.H55_DG2_2DPC(SCH_1):PAGE61; CONFIG: GENERAL; CDS_LIB: discrete; PCB Footprint: SMC0201MB; CDS_PART_NAME: CAP_0201-H76226-001,X5R,0.1UF,16V,10%,LPDB,GENERIC; CDS_LOCATION: C6112
C6113 = CAP#1: CHIPS_PART_NAME: CAP; CDS_PHYS_PART_NAME: CAP_0201-H76226-001,X5R,0.1UF,16V,10%,LPDB,GENERIC; OriginalSymbolOrigin: (-25,50); XY: (-3725,3400); VER: 2; SUITE: ADL; SUB_ROOM: HDMI_RETIMER; ROT: 0; ROOM1: HDMI; PHYS_PAGE: 61; LOCATION: C6113; DRAWING: @RVP1_ADL_SB_ADP_S_DDR5_SODIMM_2DPC_LIB.H55_DG2_2DPC(SCH_1):PAGE61; CONFIG: GENERAL; CDS_LIB: discrete; PCB Footprint: SMC0201MB; CDS_PART_NAME: CAP_0201-H76226-001,X5R,0.1UF,16V,10%,LPDB,GENERIC; CDS_LOCATION: C6113
C6114 = CAP#1: CHIPS_PART_NAME: CAP; CDS_PHYS_PART_NAME: CAP_0201-H76226-001,X5R,0.1UF,16V,10%,LPDB,GENERIC; OriginalSymbolOrigin: (-25,50); XY: (-3725,3125); VER: 2; SUITE: ADL; SUB_ROOM: HDMI_RETIMER; ROT: 0; ROOM1: HDMI; PHYS_PAGE: 61; LOCATION: C6114; DRAWING: @RVP1_ADL_SB_ADP_S_DDR5_SODIMM_2DPC_LIB.H55_DG2_2DPC(SCH_1):PAGE61; CONFIG: GENERAL; CDS_LIB: discrete; PCB Footprint: SMC0201MB; CDS_PART_NAME: CAP_0201-H76226-001,X5R,0.1UF,16V,10%,LPDB,GENERIC; CDS_LOCATION: C6114
C6115 = CAP#1: CHIPS_PART_NAME: CAP; CDS_PHYS_PART_NAME: CAP_0201-H76226-001,X5R,0.1UF,16V,10%,LPDB,GENERIC; OriginalSymbolOrigin: (-25,50); XY: (-3725,2850); VER: 2; SUITE: ADL; SUB_ROOM: HDMI_RETIMER; ROT: 0; ROOM1: HDMI; PHYS_PAGE: 61; LOCATION: C6115; DRAWING: @RVP1_ADL_SB_ADP_S_DDR5_SODIMM_2DPC_LIB.H55_DG2_2DPC(SCH_1):PAGE61; CONFIG: GENERAL; CDS_LIB: discrete; PCB Footprint: SMC0201MB; CDS_PART_NAME: CAP_0201-H76226-001,X5R,0.1UF,16V,10%,LPDB,GENERIC; CDS_LOCATION: C6115
C6116 = CAP#1: CHIPS_PART_NAME: CAP; CDS_PHYS_PART_NAME: CAP_0201-H76226-001,X5R,0.1UF,16V,10%,LPDB,GENERIC; OriginalSymbolOrigin: (-25,50); XY: (-3725,2550); VER: 2; SUITE: ADL; SUB_ROOM: HDMI_RETIMER; ROT: 0; ROOM1: HDMI; PHYS_PAGE: 61; LOCATION: C6116; DRAWING: @RVP1_ADL_SB_ADP_S_DDR5_SODIMM_2DPC_LIB.H55_DG2_2DPC(SCH_1):PAGE61; CONFIG: GENERAL; CDS_LIB: discrete; PCB Footprint: SMC0201MB; CDS_PART_NAME: CAP_0201-H76226-001,X5R,0.1UF,16V,10%,LPDB,GENERIC; CDS_LOCATION: C6116
C6117 = C_CAP: CDS_PHYS_PART_NAME: C_CAP_0402-A36096-100,X7R,0.01UF,50V,10%,TK2,GENERIC; CDS_LMAN_SYM_OUTLINE: -50,50,50,-50; FP_TECH: TK2; IP: GENERIC; ROOM: NONE; OriginalSymbolOrigin: (-50,25); XY: (-3725,1425); VER: 1; ROT: 0; PHYS_PAGE: 61; LOCATION: C6117; DRAWING: @RVP1_ADL_SB_ADP_S_DDR5_SODIMM_2DPC_LIB.H55_DG2_2DPC(SCH_1):PAGE61; CDS_LIB: c_discrete; VARIANT: ?; PCB Footprint: CTK2_SM0402_1050X550_MA; CHIPS_PART_NAME: C_CAP; CDS_PART_NAME: C_CAP_0402-A36096-100,X7R,0.01UF,50V,10%,TK2,GENERIC; CDS_LOCATION: C6117
C6118 = CAP: CDS_PHYS_PART_NAME: CAP_0402-A36096-043,X5R,0.1UF,10V,10%,LPDB,GENERIC; OriginalSymbolOrigin: (-50,25); XY: (-3650,1925); VER: 1; ROT: 0; PHYS_PAGE: 61; LOCATION: C6118; IP: GENERIC; FP_TECH: LPDB; DRAWING: @RVP1_ADL_SB_ADP_S_DDR5_SODIMM_2DPC_LIB.H55_DG2_2DPC(SCH_1):PAGE61; CDS_LIB: discrete; PCB Footprint: SMC0402IA; CHIPS_PART_NAME: CAP; CDS_PART_NAME: CAP_0402-A36096-043,X5R,0.1UF,10V,10%,LPDB,GENERIC; CDS_LOCATION: C6118
C6119 = CAP: CDS_PHYS_PART_NAME: CAP_0402-A36096-043,X5R,0.1UF,10V,10%,LPDB,GENERIC; OriginalSymbolOrigin: (-50,25); XY: (-3250,1925); VER: 1; ROT: 0; PHYS_PAGE: 61; LOCATION: C6119; IP: GENERIC; FP_TECH: LPDB; DRAWING: @RVP1_ADL_SB_ADP_S_DDR5_SODIMM_2DPC_LIB.H55_DG2_2DPC(SCH_1):PAGE61; CDS_LIB: discrete; PCB Footprint: SMC0402IA; CHIPS_PART_NAME: CAP; CDS_PART_NAME: CAP_0402-A36096-043,X5R,0.1UF,10V,10%,LPDB,GENERIC; CDS_LOCATION: C6119
C6120 = C_CAP: CDS_PHYS_PART_NAME: C_CAP_0402-A36096-100,X7R,0.01UF,50V,10%,TK2,GENERIC; CDS_LMAN_SYM_OUTLINE: -50,50,50,-50; FP_TECH: TK2; IP: GENERIC; ROOM: NONE; OriginalSymbolOrigin: (-50,25); XY: (-2850,1925); VER: 1; ROT: 0; PHYS_PAGE: 61; LOCATION: C6120; DRAWING: @RVP1_ADL_SB_ADP_S_DDR5_SODIMM_2DPC_LIB.H55_DG2_2DPC(SCH_1):PAGE61; CDS_LIB: c_discrete; VARIANT: ?; PCB Footprint: CTK2_SM0402_1050X550_MA; CHIPS_PART_NAME: C_CAP; CDS_PART_NAME: C_CAP_0402-A36096-100,X7R,0.01UF,50V,10%,TK2,GENERIC; CDS_LOCATION: C6120
C6121 = CAP: CDS_PHYS_PART_NAME: CAP_0201-D70538-003,X7R,0.01UF,10V,10%,LPDB,GENERIC; OriginalSymbolOrigin: (-50,25); XY: (-2575,300); VER: 1; SUITE: ADL; SUB_ROOM: HDMI_RETIMER; ROT: 2; ROOM1: HDMI; PHYS_PAGE: 61; LOCATION: C6121; DRAWING: @RVP1_ADL_SB_ADP_S_DDR5_SODIMM_2DPC_LIB.H55_DG2_2DPC(SCH_1):PAGE61; CONFIG: GENERAL; CDS_LIB: discrete; PCB Footprint: SMC0201IA; CHIPS_PART_NAME: CAP; CDS_PART_NAME: CAP_0201-D70538-003,X7R,0.01UF,10V,10%,LPDB,GENERIC; CDS_LOCATION: C6121
C6122 = CAP: CDS_PHYS_PART_NAME: CAP_0402-A36096-110,X5R,0.1UF,16V,10%,LPDB,GENERIC; OriginalSymbolOrigin: (-50,25); XY: (-2150,300); VER: 1; ROT: 0; PHYS_PAGE: 61; LOCATION: C6122; DRAWING: @RVP1_ADL_SB_ADP_S_DDR5_SODIMM_2DPC_LIB.H55_DG2_2DPC(SCH_1):PAGE61; CDS_LIB: discrete; PCB Footprint: SMC0402IA; CHIPS_PART_NAME: CAP; CDS_PART_NAME: CAP_0402-A36096-110,X5R,0.1UF,16V,10%,LPDB,GENERIC; CDS_LOCATION: C6122
C6123 = CAP: CDS_PHYS_PART_NAME: CAP_0402-A36096-110,X5R,0.1UF,16V,10%,LPDB,GENERIC; OriginalSymbolOrigin: (-50,25); XY: (-1700,300); VER: 1; ROT: 0; PHYS_PAGE: 61; LOCATION: C6123; DRAWING: @RVP1_ADL_SB_ADP_S_DDR5_SODIMM_2DPC_LIB.H55_DG2_2DPC(SCH_1):PAGE61; CDS_LIB: discrete; PCB Footprint: SMC0402IA; CHIPS_PART_NAME: CAP; CDS_PART_NAME: CAP_0402-A36096-110,X5R,0.1UF,16V,10%,LPDB,GENERIC; CDS_LOCATION: C6123
C6124 = CAP#1: CHIPS_PART_NAME: CAP; CDS_PHYS_PART_NAME: CAP_0201-H76226-001,X5R,0.1UF,16V,10%,LPDB,GENERIC; OriginalSymbolOrigin: (-25,50); XY: (-1425,4450); VER: 2; ROT: 0; PHYS_PAGE: 61; LOCATION: C6124; DRAWING: @RVP1_ADL_SB_ADP_S_DDR5_SODIMM_2DPC_LIB.H55_DG2_2DPC(SCH_1):PAGE61; CDS_LIB: discrete; PCB Footprint: SMC0201MB; CDS_PART_NAME: CAP_0201-H76226-001,X5R,0.1UF,16V,10%,LPDB,GENERIC; CDS_LOCATION: C6124
EU6101 = C_PS8409A: CDS_PHYS_PART_NAME: C_PS8409A_LCC-M76945-001,IC,PS8409AQFN48GTR2-C0,TK2,GENERIC; CDS_LMAN_SYM_OUTLINE: -500,1050,500,-1100; FP_TECH: TK2; IP: GENERIC; PACK_TYPE: LCC; ROOM: NONE; OriginalSymbolOrigin: (-550,1050); XY: (300,3325); VER: 1; ROT: 0; PHYS_PAGE: 61; LOCATION: EU6101; DRAWING: @RVP1_ADL_SB_ADP_S_DDR5_SODIMM_2DPC_LIB.H55_DG2_2DPC(SCH_1):PAGE61; CDS_LIB: local; VARIANT: ?; PCB Footprint: CTK2_LCC48_S6100_400_DFS4500_MA; SEC_TYPE: LCC; CHIPS_PART_NAME: C_PS8409A; CDS_PART_NAME: C_PS8409A_LCC-M76945-001,IC,PS8409AQFN48GTR2-C0,TK2,GENERIC; CDS_LOCATION: EU6101
FB6101 = C_FERRITE: CDS_PHYS_PART_NAME: C_FERRITE_0805-656554-016,FB,330,25%,1.5A,TK0,GENERIC; CDS_LMAN_SYM_OUTLINE: -50,50,50,-50; FP_TECH: TK0; IP: GENERIC; ROOM: NONE; OriginalSymbolOrigin: (-75,50); XY: (-4350,2125); VER: 1; ROT: 0; PHYS_PAGE: 61; LOCATION: FB6101; DRAWING: @RVP1_ADL_SB_ADP_S_DDR5_SODIMM_2DPC_LIB.H55_DG2_2DPC(SCH_1):PAGE61; CDS_LIB: c_discrete; VARIANT: ?; PCB Footprint: CTK0_SM0805_2200X1450_MA; CHIPS_PART_NAME: C_FERRITE; CDS_PART_NAME: C_FERRITE_0805-656554-016,FB,330,25%,1.5A,TK0,GENERIC; CDS_LOCATION: FB6101
R6101 = RES#1: CHIPS_PART_NAME: RES; CDS_PHYS_PART_NAME: RES_0201-C80792-009,EMPTY,0,5%,1/20W,LPDB,GENERIC; OriginalSymbolOrigin: (-75,25); XY: (-1475,1575); VER: 1; PHYS_PAGE: 61; LOCATION: R6101; IP: GENERIC; FP_TECH: LPDB; DRAWING: @RVP1_ADL_SB_ADP_S_DDR5_SODIMM_2DPC_LIB.H55_DG2_2DPC(SCH_1):PAGE61; CDS_LIB: discrete; PCB Footprint: SMR0201IA; SEC_TYPE: 0201; ROT: 0; CDS_PART_NAME: RES_0201-C80792-009,EMPTY,0,5%,1/20W,LPDB,GENERIC; CDS_LOCATION: R6101
R6102 = RES#1: CHIPS_PART_NAME: RES; CDS_PHYS_PART_NAME: RES_0201-C80792-009,EMPTY,0,5%,1/20W,LPDB,GENERIC; OriginalSymbolOrigin: (-75,25); XY: (-1375,1225); VER: 1; PHYS_PAGE: 61; LOCATION: R6102; IP: GENERIC; FP_TECH: LPDB; DRAWING: @RVP1_ADL_SB_ADP_S_DDR5_SODIMM_2DPC_LIB.H55_DG2_2DPC(SCH_1):PAGE61; CDS_LIB: discrete; PCB Footprint: SMR0201IA; SEC_TYPE: 0201; ROT: 0; CDS_PART_NAME: RES_0201-C80792-009,EMPTY,0,5%,1/20W,LPDB,GENERIC; CDS_LOCATION: R6102
R6103 = RES#1: CHIPS_PART_NAME: RES; CDS_PHYS_PART_NAME: RES_0603-H10619-001,CHIP,10MOHM,1%,1/10W,LPDB,GENERIC; OriginalSymbolOrigin: (-75,25); XY: (1750,4400); VER: 1; ROT: 0; PHYS_PAGE: 61; LOCATION: R6103; IP: GENERIC; FP_TECH: LPDB; DRAWING: @RVP1_ADL_SB_ADP_S_DDR5_SODIMM_2DPC_LIB.H55_DG2_2DPC(SCH_1):PAGE61; CDS_LIB: discrete; PCB Footprint: SMR0603IC; SEC_TYPE: 0603; CDS_PART_NAME: RES_0603-H10619-001,CHIP,10MOHM,1%,1/10W,LPDB,GENERIC; CDS_LOCATION: R6103
R6104 = RES: CDS_PHYS_PART_NAME: RES_0402-A93548-202,CHIP,4.99K,1%,1/16W,LPDB,GENERIC; OriginalSymbolOrigin: (-25,75); XY: (-1875,2625); VER: 2; ROT: 0; PHYS_PAGE: 61; LOCATION: R6104; IP: GENERIC; FP_TECH: LPDB; DRAWING: @RVP1_ADL_SB_ADP_S_DDR5_SODIMM_2DPC_LIB.H55_DG2_2DPC(SCH_1):PAGE61; CDS_LIB: discrete; PCB Footprint: SMR0402IA; CHIPS_PART_NAME: RES; CDS_PART_NAME: RES_0402-A93548-202,CHIP,4.99K,1%,1/16W,LPDB,GENERIC; CDS_LOCATION: R6104
R6105 = RES: CDS_PHYS_PART_NAME: RES_0201-C80792-025,CHIP,2.2K,5%,1/20W,LPDB,GENERIC; OriginalSymbolOrigin: (-25,75); XY: (-1200,1950); VER: 2; ROT: 0; PHYS_PAGE: 61; LOCATION: R6105; IP: GENERIC; FP_TECH: LPDB; DRAWING: @RVP1_ADL_SB_ADP_S_DDR5_SODIMM_2DPC_LIB.H55_DG2_2DPC(SCH_1):PAGE61; CDS_LIB: discrete; PCB Footprint: SMR0201IA; CHIPS_PART_NAME: RES; CDS_PART_NAME: RES_0201-C80792-025,CHIP,2.2K,5%,1/20W,LPDB,GENERIC; CDS_LOCATION: R6105
R6106 = RES: CDS_PHYS_PART_NAME: RES_0201-C48657-004,CHIP,10K,1%,1/20W,LPDB,GENERIC; OriginalSymbolOrigin: (-25,75); XY: (-775,4650); VER: 2; SUITE: ADL; SUB_ROOM: HDMI_RETIMER; ROT: 0; ROOM1: HDMI; PHYS_PAGE: 61; LOCATION: R6106; IP: GENERIC; FP_TECH: LPDB; DRAWING: @RVP1_ADL_SB_ADP_S_DDR5_SODIMM_2DPC_LIB.H55_DG2_2DPC(SCH_1):PAGE61; CONFIG: GENERAL; CDS_LIB: discrete; PCB Footprint: SMR0201IA; CHIPS_PART_NAME: RES; CDS_PART_NAME: RES_0201-C48657-004,CHIP,10K,1%,1/20W,LPDB,GENERIC; CDS_LOCATION: R6106
R6107 = RES: CDS_PHYS_PART_NAME: RES_0201-C80792-025,CHIP,2.2K,5%,1/20W,LPDB,GENERIC; OriginalSymbolOrigin: (-25,75); XY: (-750,1925); VER: 2; ROT: 0; PHYS_PAGE: 61; LOCATION: R6107; IP: GENERIC; FP_TECH: LPDB; DRAWING: @RVP1_ADL_SB_ADP_S_DDR5_SODIMM_2DPC_LIB.H55_DG2_2DPC(SCH_1):PAGE61; CDS_LIB: discrete; PCB Footprint: SMR0201IA; CHIPS_PART_NAME: RES; CDS_PART_NAME: RES_0201-C80792-025,CHIP,2.2K,5%,1/20W,LPDB,GENERIC; CDS_LOCATION: R6107
R6108 = RES: CDS_PHYS_PART_NAME: RES_0201-C48657-004,EMPTY,10K,1%,1/20W,LPDB,GENERIC; OriginalSymbolOrigin: (-25,75); XY: (350,1125); VER: 2; SUITE: ADL; SUB_ROOM: HDMI_RETIMER; ROT: 0; ROOM1: HDMI; PHYS_PAGE: 61; LOCATION: R6108; IP: GENERIC; FP_TECH: LPDB; DRAWING: @RVP1_ADL_SB_ADP_S_DDR5_SODIMM_2DPC_LIB.H55_DG2_2DPC(SCH_1):PAGE61; CONFIG: GENERAL; CDS_LIB: discrete; PCB Footprint: SMR0201IA; CHIPS_PART_NAME: RES; CDS_PART_NAME: RES_0201-C48657-004,EMPTY,10K,1%,1/20W,LPDB,GENERIC; CDS_LOCATION: R6108
R6109 = RES: CDS_PHYS_PART_NAME: RES_0201-C48657-004,EMPTY,10K,1%,1/20W,LPDB,GENERIC; OriginalSymbolOrigin: (-25,75); XY: (725,1150); VER: 2; SUITE: ADL; SUB_ROOM: HDMI_RETIMER; ROT: 0; ROOM1: HDMI; PHYS_PAGE: 61; LOCATION: R6109; IP: GENERIC; FP_TECH: LPDB; DRAWING: @RVP1_ADL_SB_ADP_S_DDR5_SODIMM_2DPC_LIB.H55_DG2_2DPC(SCH_1):PAGE61; CONFIG: GENERAL; CDS_LIB: discrete; PCB Footprint: SMR0201IA; CHIPS_PART_NAME: RES; CDS_PART_NAME: RES_0201-C48657-004,EMPTY,10K,1%,1/20W,LPDB,GENERIC; CDS_LOCATION: R6109
R6110 = RES: CDS_PHYS_PART_NAME: RES_0201-C48657-004,CHIP,10K,1%,1/20W,LPDB,GENERIC; OriginalSymbolOrigin: (-25,75); XY: (1375,675); VER: 2; SUITE: ADL; SUB_ROOM: HDMI_RETIMER; ROT: 0; ROOM1: HDMI; PHYS_PAGE: 61; LOCATION: R6110; IP: GENERIC; FP_TECH: LPDB; DRAWING: @RVP1_ADL_SB_ADP_S_DDR5_SODIMM_2DPC_LIB.H55_DG2_2DPC(SCH_1):PAGE61; CONFIG: GENERAL; CDS_LIB: discrete; PCB Footprint: SMR0201IA; CHIPS_PART_NAME: RES; CDS_PART_NAME: RES_0201-C48657-004,CHIP,10K,1%,1/20W,LPDB,GENERIC; CDS_LOCATION: R6110
R6111 = RES#1: CHIPS_PART_NAME: RES; CDS_PHYS_PART_NAME: RES_0201-C80792-009,CHIP,0,5%,1/20W,LPDB,GENERIC; OriginalSymbolOrigin: (-75,25); XY: (1600,1875); VER: 1; SUITE: ADL; SUB_ROOM: HDMI_RETIMER; ROOM1: HDMI; PHYS_PAGE: 61; LOCATION: R6111; IP: GENERIC; FP_TECH: LPDB; DRAWING: @RVP1_ADL_SB_ADP_S_DDR5_SODIMM_2DPC_LIB.H55_DG2_2DPC(SCH_1):PAGE61; CONFIG: GENERAL; CDS_LIB: discrete; PCB Footprint: SMR0201IA; ROT: 0; CDS_PART_NAME: RES_0201-C80792-009,CHIP,0,5%,1/20W,LPDB,GENERIC; CDS_LOCATION: R6111
R6112 = RES#1: CHIPS_PART_NAME: RES; CDS_PHYS_PART_NAME: RES_0201-C80792-009,CHIP,0,5%,1/20W,LPDB,GENERIC; OriginalSymbolOrigin: (-75,25); XY: (1600,1825); VER: 1; SUITE: ADL; SUB_ROOM: HDMI_RETIMER; ROOM1: HDMI; PHYS_PAGE: 61; LOCATION: R6112; IP: GENERIC; FP_TECH: LPDB; DRAWING: @RVP1_ADL_SB_ADP_S_DDR5_SODIMM_2DPC_LIB.H55_DG2_2DPC(SCH_1):PAGE61; CONFIG: GENERAL; CDS_LIB: discrete; PCB Footprint: SMR0201IA; ROT: 0; CDS_PART_NAME: RES_0201-C80792-009,CHIP,0,5%,1/20W,LPDB,GENERIC; CDS_LOCATION: R6112
R6113 = RES: CDS_PHYS_PART_NAME: RES_0201-C48657-004,CHIP,10K,1%,1/20W,LPDB,GENERIC; OriginalSymbolOrigin: (-25,75); XY: (1750,675); VER: 2; SUITE: ADL; SUB_ROOM: HDMI_RETIMER; ROT: 0; ROOM1: HDMI; PHYS_PAGE: 61; LOCATION: R6113; IP: GENERIC; FP_TECH: LPDB; DRAWING: @RVP1_ADL_SB_ADP_S_DDR5_SODIMM_2DPC_LIB.H55_DG2_2DPC(SCH_1):PAGE61; CONFIG: GENERAL; CDS_LIB: discrete; PCB Footprint: SMR0201IA; CHIPS_PART_NAME: RES; CDS_PART_NAME: RES_0201-C48657-004,CHIP,10K,1%,1/20W,LPDB,GENERIC; CDS_LOCATION: R6113
R6114 = RES#1: CHIPS_PART_NAME: RES; CDS_PHYS_PART_NAME: RES_0201-C80792-009,CHIP,0,5%,1/20W,LPDB,GENERIC; OriginalSymbolOrigin: (-75,25); XY: (1775,2625); VER: 1; SUITE: ADL; SUB_ROOM: HDMI_RETIMER; ROOM1: HDMI; PHYS_PAGE: 61; LOCATION: R6114; IP: GENERIC; FP_TECH: LPDB; DRAWING: @RVP1_ADL_SB_ADP_S_DDR5_SODIMM_2DPC_LIB.H55_DG2_2DPC(SCH_1):PAGE61; CONFIG: GENERAL; CDS_LIB: discrete; PCB Footprint: SMR0201IA; ROT: 0; CDS_PART_NAME: RES_0201-C80792-009,CHIP,0,5%,1/20W,LPDB,GENERIC; CDS_LOCATION: R6114
R6115 = RES: CDS_PHYS_PART_NAME: RES_0201-C48657-004,CHIP,10K,1%,1/20W,LPDB,GENERIC; OriginalSymbolOrigin: (-25,75); XY: (2100,700); VER: 2; SUITE: ADL; SUB_ROOM: DG1_STRAP; ROT: 0; ROOM1: DG1_MISC; PHYS_PAGE: 61; LOCATION: R6115; IP: GENERIC; FP_TECH: LPDB; DRAWING: @RVP1_ADL_SB_ADP_S_DDR5_SODIMM_2DPC_LIB.H55_DG2_2DPC(SCH_1):PAGE61; CONFIG: GENERAL; CDS_LIB: discrete; PCB Footprint: SMR0201IA; CHIPS_PART_NAME: RES; CDS_PART_NAME: RES_0201-C48657-004,CHIP,10K,1%,1/20W,LPDB,GENERIC; CDS_LOCATION: R6115
R6116 = RES: CDS_PHYS_PART_NAME: RES_0201-C48657-004,CHIP,10K,1%,1/20W,LPDB,GENERIC; OriginalSymbolOrigin: (-25,75); XY: (2350,3075); VER: 2; SUITE: ADL; SUB_ROOM: HDMI_RETIMER; ROT: 0; ROOM1: HDMI; PHYS_PAGE: 61; LOCATION: R6116; IP: GENERIC; FP_TECH: LPDB; DRAWING: @RVP1_ADL_SB_ADP_S_DDR5_SODIMM_2DPC_LIB.H55_DG2_2DPC(SCH_1):PAGE61; CONFIG: GENERAL; CDS_LIB: discrete; PCB Footprint: SMR0201IA; CHIPS_PART_NAME: RES; CDS_PART_NAME: RES_0201-C48657-004,CHIP,10K,1%,1/20W,LPDB,GENERIC; CDS_LOCATION: R6116
R6117 = RES: CDS_PHYS_PART_NAME: RES_0402-A93548-599,EMPTY,10K,1%,1/16W,LPDB,GENERIC; OriginalSymbolOrigin: (-25,75); XY: (2325,1500); VER: 2; SUITE: ADL; SUB_ROOM: HDMI_RETIMER; ROT: 0; ROOM1: HDMI; PHYS_PAGE: 61; LOCATION: R6117; DRAWING: @RVP1_ADL_SB_ADP_S_DDR5_SODIMM_2DPC_LIB.H55_DG2_2DPC(SCH_1):PAGE61; CONFIG: GENERAL; CDS_LIB: discrete; PCB Footprint: SMR0402IA; CHIPS_PART_NAME: RES; CDS_PART_NAME: RES_0402-A93548-599,EMPTY,10K,1%,1/16W,LPDB,GENERIC; CDS_LOCATION: R6117
TP6101 = TP: PART_NUMBER: NA_TPS16; CDS_PHYS_PART_NAME: TP_SM-NA_TPS16,EMPTY,TPS16,LPDB,GENERIC; CDS_LMAN_SYM_OUTLINE: -100,100,100,-150; PACK_TYPE: SM; OriginalSymbolOrigin: (-50,50); XY: (-275,975); VER: 4; TOLERANCE: 5%; SUB_ROOM: DECAP; ROT: 1; PHYS_PAGE: 61; LOCATION: TP6101; IP: GENERIC; FP_TECH: LPDB; DRAWING: @RVP1_ADL_SB_ADP_S_DDR5_SODIMM_2DPC_LIB.H55_DG2_2DPC(SCH_1):PAGE61; CDS_LIB: board_artifacts; PCB Footprint: TPS16; CHIPS_PART_NAME: TP; CDS_PART_NAME: TP_SM-NA_TPS16,EMPTY,TPS16,LPDB,GENERIC; CDS_LOCATION: TP6101
TP6102 = TP: PART_NUMBER: NA_TPS16; CDS_PHYS_PART_NAME: TP_SM-NA_TPS16,EMPTY,TPS16,LPDB,GENERIC; CDS_LMAN_SYM_OUTLINE: -100,100,100,-150; PACK_TYPE: SM; OriginalSymbolOrigin: (-50,50); XY: (-275,825); VER: 4; TOLERANCE: 5%; SUB_ROOM: DECAP; ROT: 1; PHYS_PAGE: 61; LOCATION: TP6102; IP: GENERIC; FP_TECH: LPDB; DRAWING: @RVP1_ADL_SB_ADP_S_DDR5_SODIMM_2DPC_LIB.H55_DG2_2DPC(SCH_1):PAGE61; CDS_LIB: board_artifacts; PCB Footprint: TPS16; CHIPS_PART_NAME: TP; CDS_PART_NAME: TP_SM-NA_TPS16,EMPTY,TPS16,LPDB,GENERIC; CDS_LOCATION: TP6102
TP6103 = TP: PART_NUMBER: NA_TPS16; CDS_PHYS_PART_NAME: TP_SM-NA_TPS16,EMPTY,TPS16,LPDB,GENERIC; CDS_LMAN_SYM_OUTLINE: -100,100,100,-150; PACK_TYPE: SM; OriginalSymbolOrigin: (-50,50); XY: (-275,700); VER: 4; TOLERANCE: 5%; SUB_ROOM: DECAP; ROT: 1; PHYS_PAGE: 61; LOCATION: TP6103; IP: GENERIC; FP_TECH: LPDB; DRAWING: @RVP1_ADL_SB_ADP_S_DDR5_SODIMM_2DPC_LIB.H55_DG2_2DPC(SCH_1):PAGE61; CDS_LIB: board_artifacts; PCB Footprint: TPS16; CHIPS_PART_NAME: TP; CDS_PART_NAME: TP_SM-NA_TPS16,EMPTY,TPS16,LPDB,GENERIC; CDS_LOCATION: TP6103